# Altium schematic sheet HFM_Can_AX_Eeprom_V1.SchDoc
size A4
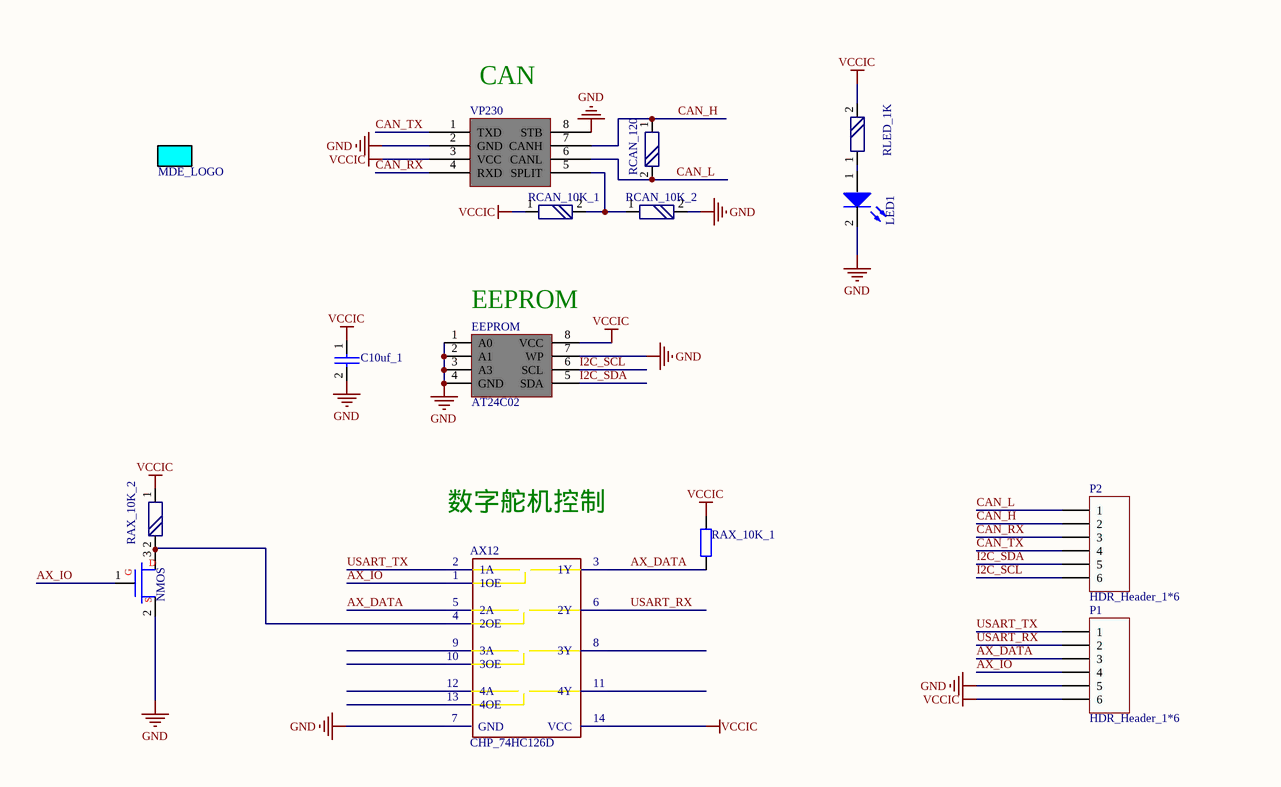
[diagram p0: HFM_Can_AX_Eeprom_V1.SchDoc, left]
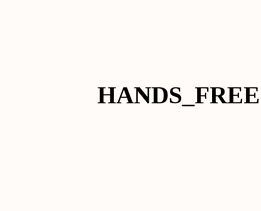
[diagram p1: HFM_Can_AX_Eeprom_V1.SchDoc, right]

## Parts
*  MDE_LOGO  [MDE_LOGO_Overlay]
AX12  CHP_74HC126D  [CHP_SOP_14P]
C10uf_1  ELE_Cap_10uf  [ELE_0805_P]  (value not drawn)
EEPROM  AT24C02  [CHP_SOP_8P]
LED1  ELE_LED  [ELE_0805极性_P]  (value not drawn)
NMOS  SIS412DN  [CHP_SOT23_P_3P]  (value not drawn)
P1  HDR_Header_1*6  [HDR_STAMPHOLE_2.00_DH_1*6]
P2  HDR_Header_1*6  [HDR_STAMPHOLE_2.00_DH_1*6]
RAX_10K_1  Res2  [ELE_0805_P]  (value not drawn)
RAX_10K_2  ELE_RES_1  [ELE_0805_P]  (value not drawn)
RCAN_10K_1  ELE_RES_1  [ELE_0805_P]  (value not drawn)
RCAN_10K_2  ELE_RES_1  [ELE_0805_P]  (value not drawn)
RCAN_120  ELE_RES_1  [ELE_0805_P]  (value not drawn)
RLED_1K  ELE_RES_1  [ELE_0805_P]  (value not drawn)
VP230  CHP_VP230_P  [CHP_VP230_P]  (value not drawn)

## Nets
GND: AX12.7(GND) C10uf_1.2 EEPROM.1(A0) EEPROM.2(A1) EEPROM.3(A3) EEPROM.4(GND) EEPROM.7(WP) LED1.2 NMOS.2(S) P1.5 RCAN_10K_2.2 VP230.2(GND) VP230.8(STB)
VCCIC: AX12.14(VCC) C10uf_1.1 EEPROM.8(VCC) P1.6 RAX_10K_1.2 RAX_10K_2.1 RCAN_10K_1.1 RLED_1K.2 VP230.3(VCC)
AX_DATA: AX12.3(1Y) AX12.5(2A) P1.3 RAX_10K_1.1
AX_IO: AX12.1(1OE) NMOS.1(G) P1.4
CAN_H: P2.2 RCAN_120.1 VP230.7(CANH)
CAN_L: P2.1 RCAN_120.2 VP230.6(CANL)
CAN_RX: P2.3 VP230.4(RXD)
CAN_TX: P2.4 VP230.1(TXD)
I2C_SCL: EEPROM.6(SCL) P2.6
I2C_SDA: EEPROM.5(SDA) P2.5
USART_RX: AX12.6(2Y) P1.2
USART_TX: AX12.2(1A) P1.1
NetAX12_4: AX12.4(2OE) NMOS.3(D) RAX_10K_2.2
NetLED1_1: LED1.1 RLED_1K.1
NetRCAN_10K_1_2: RCAN_10K_1.2 RCAN_10K_2.1 VP230.5(SPLIT)

Not connected (* = marked no-connect by the designer): AX12 8(3Y) 9(3A) 10(3OE) 11(4Y) 12(4A) 13(4OE)

## Notes on the sheet
- (near VP230) CAN
- (near EEPROM) EEPROM
- (near AX12) 数字舵机控制
- HANDS_FREE

## Library data of the parts
AX12 = CHP_74HC126D: 4路三态门缓冲器
C10uf_1 = ELE_Cap_10uf: 电容10uf固定
EEPROM = CHP_AT24C0X: Polarized Capacitor (Radial); Published: 8-Jun-2000; LatestRevisionDate: 17-Jul-2002; LatestRevisionNote: Re-released for DXP Platform.; PackageReference: RB7.6-15; Publisher: Altium Limited; Value: AT24C0X
LED1 = ELE_LED: 发光二极管; Published: 8-Jun-2000; LatestRevisionDate: 17-Jul-2002; LatestRevisionNote: Re-released for DXP Platform.; PackageDocument: Feb-2002; PackageReference: 3.2X1.6X1.1; Publisher: Altium Limited
NMOS = ELE_NMOS_1: MOS管; Note: Pin 2 is electrically connected to pin 4.; Published: 8-Jun-2000; LatestRevisionDate: 17-Jul-2002; LatestRevisionNote: Re-released for DXP Platform.; DatasheetDocument: PD-9.814; PackageReference: TO-220AB; Publisher: Altium Limited; Code_JEDEC: TO-220-AB; ComponentLink1Description: Manufacturer Link; ComponentLink1URL: http://www.irf.com/
RAX_10K_1 = Res2: Resistor; Value: 1K; Published: 8-Jun-2000; LatestRevisionDate: 17-Jul-2002; LatestRevisionNote: Re-released for DXP Platform.; PackageReference: AXIAL-0.4; Publisher: Altium Limited
RAX_10K_2 RCAN_10K_1 RCAN_10K_2 RCAN_120 RLED_1K = ELE_RES_1: 电阻
P1 P2 = HDR_Header_1*6: LatestRevisionDate: 17-Jul-2002; LatestRevisionNote: Re-released for DXP Platform.; Publisher: Altium Limited